# EAGLE design grblduino (EAGLE 5.11)
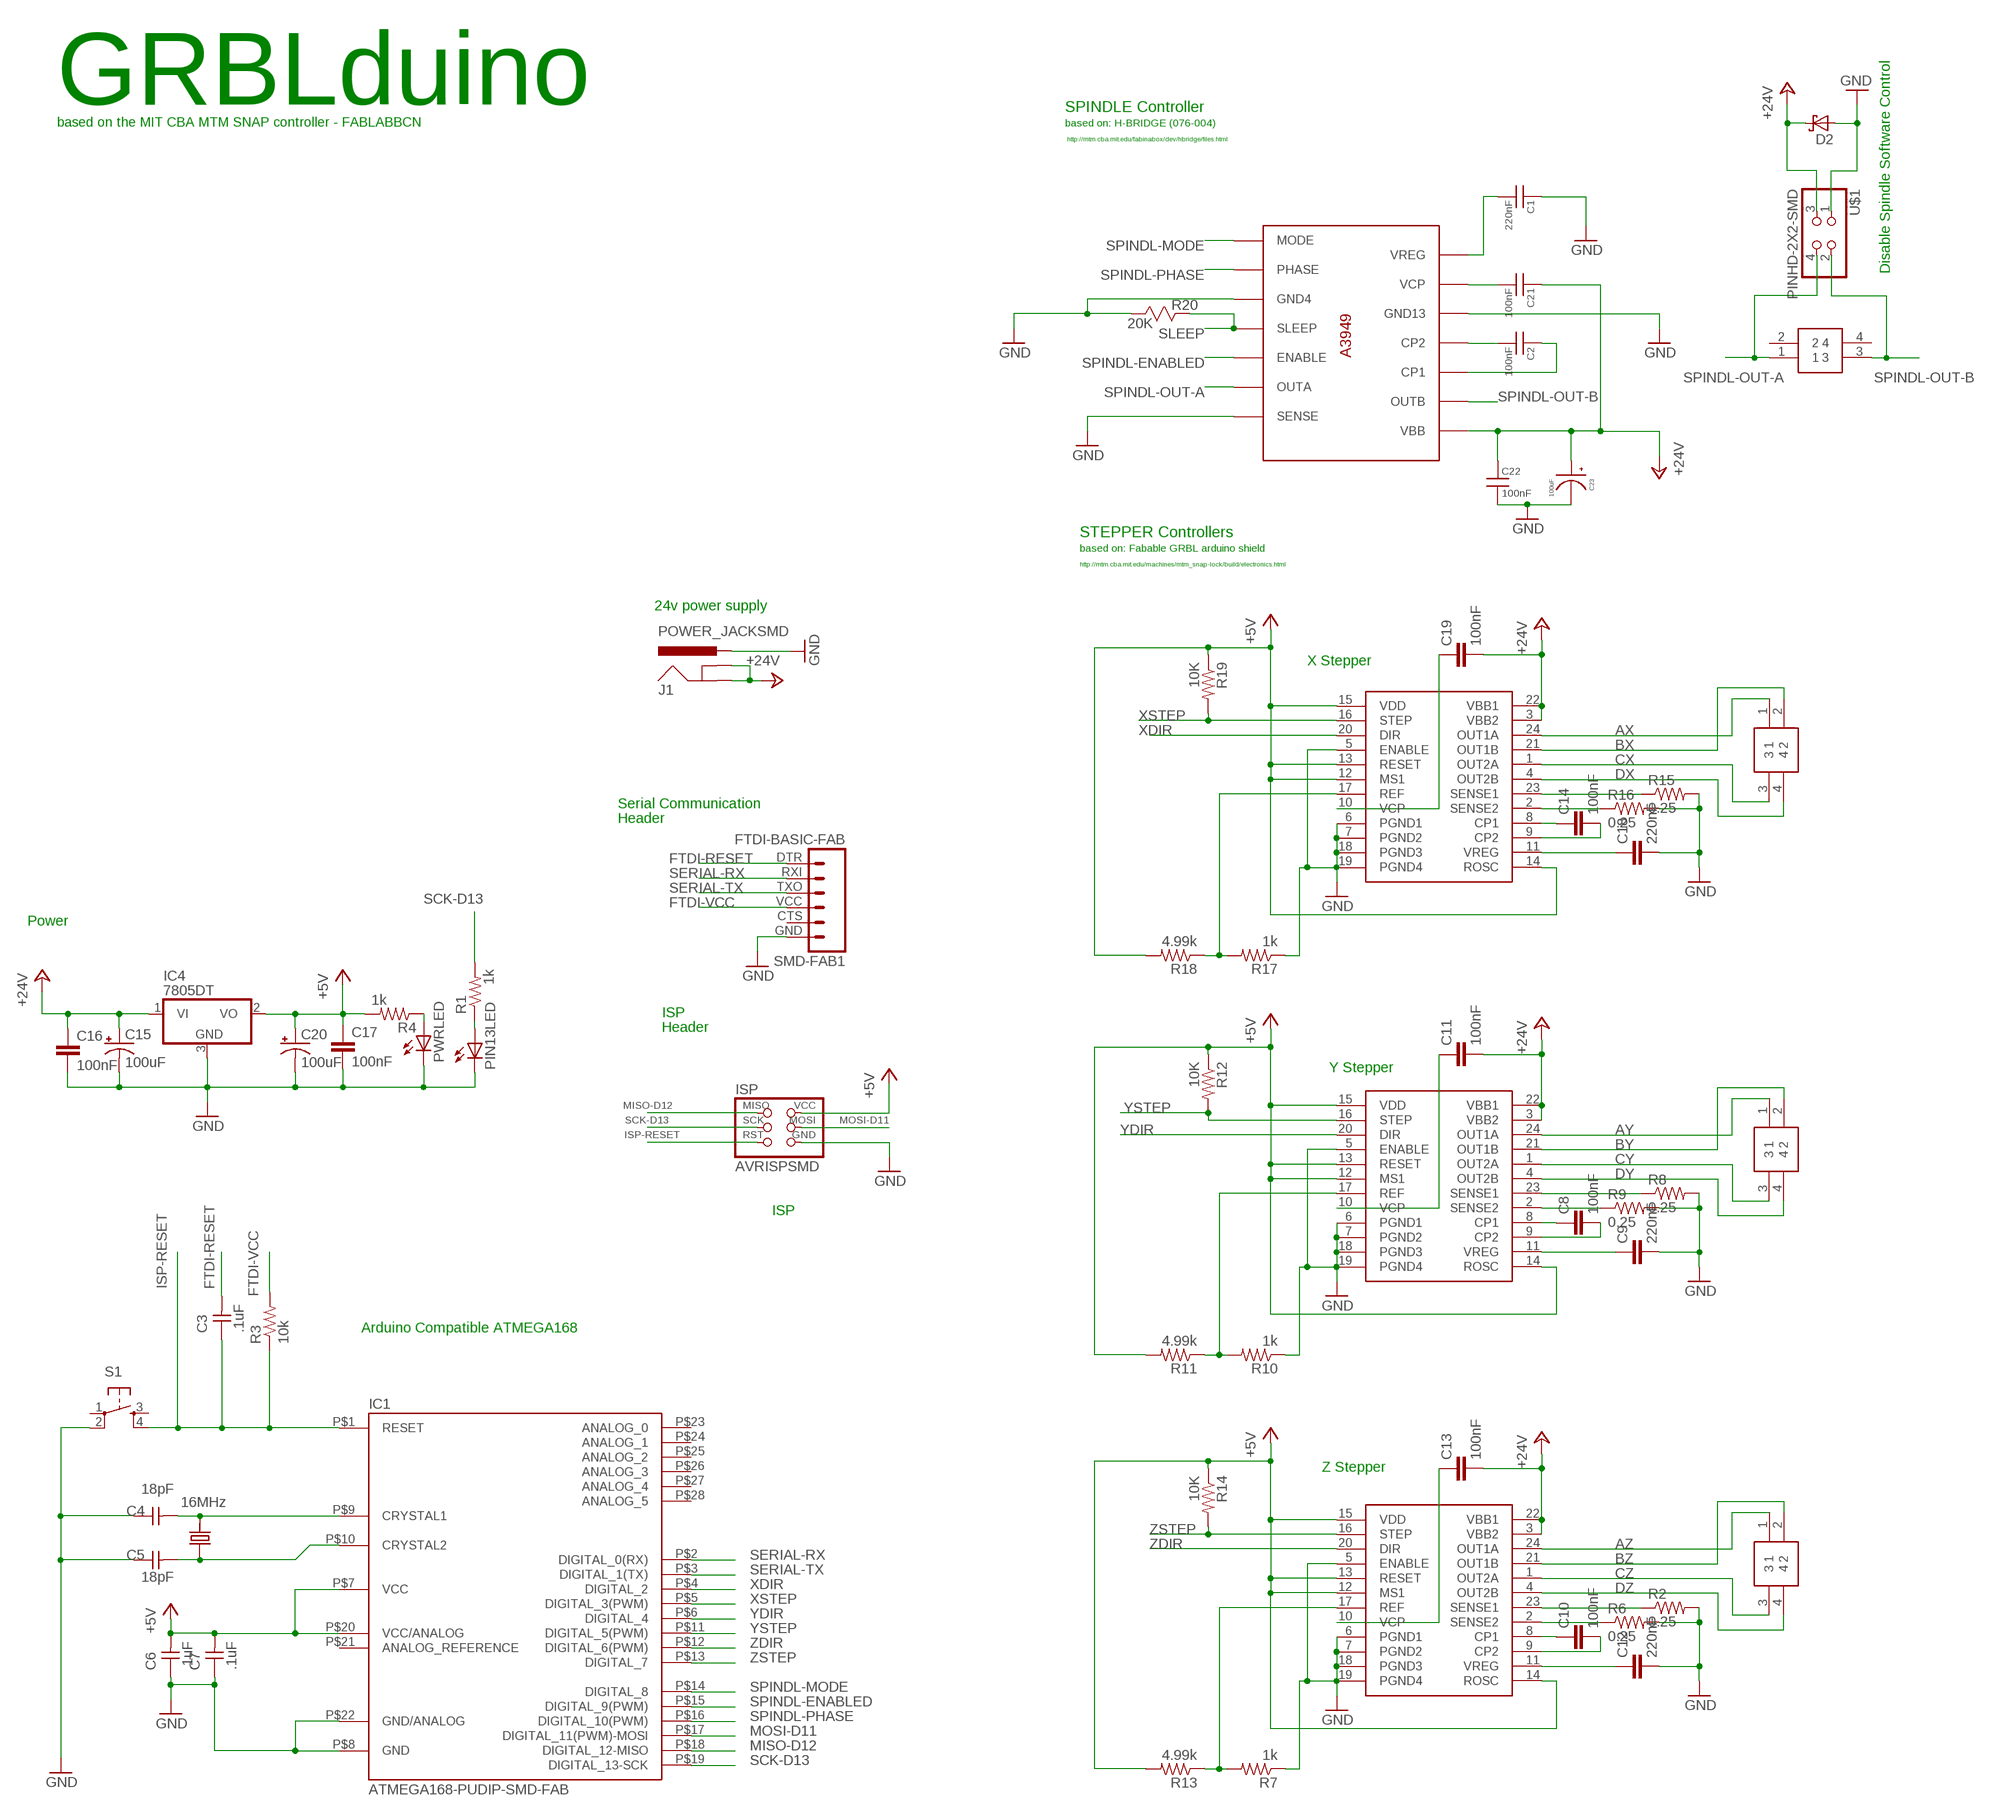
[diagram p0: schematic, sheet 1]

## Parts
C1  220nF  CAP_NONPOLARC1206  [C1206]
C2  100nF  CAP_NONPOLARC1206  [C1206]
C3  .1uF  UNPOLARIZED_CAPACITOR1206  [1206]
C4  18pF  UNPOLARIZED_CAPACITOR1206  [1206]
C5  18pF  UNPOLARIZED_CAPACITOR1206  [1206]
C6  .1uF  UNPOLARIZED_CAPACITOR1206  [1206]
C7  .1uF  UNPOLARIZED_CAPACITOR1206  [1206]
C8  100nF  C-EUC1206  [C1206]
C9  220nF  C-EUC1206  [C1206]
C10  100nF  C-EUC1206  [C1206]
C11  100nF  C-EUC1206  [C1206]
C12  220nF  C-EUC1206  [C1206]
C13  100nF  C-EUC1206  [C1206]
C14  100nF  C-EUC1206  [C1206]
C15  100uF  CPOL-USUD-10X10  [UD-10X10_NICHICON]
C16  100nF  C-EUC1206K  [C1206K]
C17  100nF  C-EUC1206K  [C1206K]
C18  220nF  C-EUC1206  [C1206]
C19  100nF  C-EUC1206  [C1206]
C20  100uF  CPOL-USUD-10X10  [UD-10X10_NICHICON]
C21  100nF  CAP_NONPOLARC1206  [C1206]
C22  100nF  CAP_NONPOLARC1206  [C1206]
C23  100uF  POLAR_CAPACITOR100UF  [ECAP-F]
D2  SCHOTTKY-DIODESMC  [SMC]
DRIVER1  A3982  A3982SOIC24  [SO24W]
DRIVER2  A3982  A3982SOIC24  [SO24W]
DRIVER3  A3982  A3982SOIC24  [SO24W]
IC1  ATMEGA168-PUDIP-SMD-FAB  [DIL28-3-FAB-SMD]
IC4  7805DT  [TO252]
ISP  AVRISPSMD  [2X03SMD]
J1  POWER_JACKSMD  [POWER_JACK_SMD]
PIN13LED  LED1206  [1206]
PWRLED  LED1206  [1206]
Q2  16MHz  CRYSTALCS10  [CS10]
R1  1k  RESISTOR1206  [1206]
R2  0.25  R-US_R2512  [R2512]
R3  10k  RESISTOR1206  [1206]
R4  1k  RESISTOR1206  [1206]
R6  0.25  R-US_R2512  [R2512]
R7  1k  RESISTOR1206  [1206]
R8  0.25  R-US_R2512  [R2512]
R9  0.25  R-US_R2512  [R2512]
R10  1k  RESISTOR1206  [1206]
R11  4.99k  RESISTOR1206  [1206]
R12  10K  R-US_R1206  [R1206]
R13  4.99k  RESISTOR1206  [1206]
R14  10K  R-US_R1206  [R1206]
R15  0.25  R-US_R2512  [R2512]
R16  0.25  R-US_R2512  [R2512]
R17  1k  RESISTOR1206  [1206]
R18  4.99k  RESISTOR1206  [1206]
R19  10K  R-US_R1206  [R1206]
R20  20K  RESISTORR1206  [R1206]
S1  6MM_SWITCH6MM_SWITCH  [6MM_SWITCH]
SMD-FAB1  FTDI-BASIC-FAB  [1X06SMD]
U4  A3949  [SO-16DW]
U$1  PINHD-2X2-SMD  [2X02SMD]
XSTEP  4-HEADER  [4PIN-HEADER]
XSTEP1  4-HEADER  [4PIN-HEADER]
YSTEP  4-HEADER  [4PIN-HEADER]
ZSTEP  4-HEADER  [4PIN-HEADER]

## Nets
+5V [power]: C6.2 C7.2 C17.1 C20.+ DRIVER1.12(MS1) DRIVER1.13(RESET) DRIVER1.14(ROSC) DRIVER1.15(VDD) DRIVER2.12(MS1) DRIVER2.13(RESET) DRIVER2.14(ROSC) DRIVER2.15(VDD) DRIVER3.12(MS1) DRIVER3.13(RESET) DRIVER3.14(ROSC) DRIVER3.15(VDD) IC1.P$7(VCC) IC1.P$20(VCC/ANALOG) IC4.2(VO) ISP.2(VCC) R4.2 R11.2 R12.1 R13.2 R14.1 R18.2 R19.1
+24V: C11.2 C13.2 C15.+ C16.1 C19.2 C21.1(P) C22.1(P) C23.P D2.C DRIVER1.3(VBB2) DRIVER1.22(VBB1) DRIVER2.3(VBB2) DRIVER2.22(VBB1) DRIVER3.3(VBB2) DRIVER3.22(VBB1) IC4.1(VI) J1.GND(GNDBREAK) J1.P$4(GND) U4.9(VBB) U$1.3
AX [power]: DRIVER3.24(OUT1A) XSTEP.1
AY [power]: DRIVER1.24(OUT1A) YSTEP.1
AZ [power]: DRIVER2.24(OUT1A) ZSTEP.1
BX [power]: DRIVER3.21(OUT1B) XSTEP.2
BY [power]: DRIVER1.21(OUT1B) YSTEP.2
BZ [power]: DRIVER2.21(OUT1B) ZSTEP.2
CX [power]: DRIVER3.1(OUT2A) XSTEP.3
CY [power]: DRIVER1.1(OUT2A) YSTEP.3
CZ [power]: DRIVER2.1(OUT2A) ZSTEP.3
DX [power]: DRIVER3.4(OUT2B) XSTEP.4
DY [power]: DRIVER1.4(OUT2B) YSTEP.4
DZ [power]: DRIVER2.4(OUT2B) ZSTEP.4
FTDI-RESET: C3.2 SMD-FAB1.DTR
FTDI-VCC: R3.2 SMD-FAB1.VCC
GND [power]: C1.1(P) C4.1 C5.1 C6.1 C7.1 C9.2 C12.2 C15.- C16.2 C17.2 C18.2 C20.- C22.2(M) C23.N D2.A DRIVER1.5(ENABLE) DRIVER1.6(PGND1) DRIVER1.7(PGND2) DRIVER1.18(PGND3) DRIVER1.19(PGND4) DRIVER2.5(ENABLE) DRIVER2.6(PGND1) DRIVER2.7(PGND2) DRIVER2.18(PGND3) DRIVER2.19(PGND4) DRIVER3.5(ENABLE) DRIVER3.6(PGND1) DRIVER3.7(PGND2) DRIVER3.18(PGND3) DRIVER3.19(PGND4) IC1.P$8(GND) IC1.P$22(GND/ANALOG) IC4.3(GND) ISP.6(GND) J1.VIN0(PWR) PIN13LED.2(C) PWRLED.2(C) R2.2 R6.2 R7.1 R8.2 R9.2 R10.1 R15.2 R16.2 R17.1 R20.1 S1.2(P1) SMD-FAB1.GND U4.4(GND4) U4.8(SENSE) U4.13(GND13) U$1.1
ISP-RESET: C3.1 IC1.P$1(RESET) ISP.5(RST) R3.1 S1.4(S1)
MISO-D12: IC1.P$18(DIGITAL_12-MISO) ISP.1(MISO)
MOSI-D11: IC1.P$17(DIGITAL_11(PWM)-MOSI) ISP.4(MOSI)
N$1: C4.2 IC1.P$9(CRYSTAL1) Q2.P$2
N$2: PWRLED.1(A) R4.1
N$3: C2.1(P) U4.11(CP1)
N$4: PIN13LED.1(A) R1.1
N$5: C5.2 IC1.P$10(CRYSTAL2) Q2.P$1
N$7: C1.2(M) U4.15(VREG)
N$8: C2.2(M) U4.12(CP2)
N$9: C21.2(M) U4.14(VCP)
N$11 [power]: DRIVER2.23(SENSE1) R2.1
N$12 [power]: DRIVER2.2(SENSE2) R6.1
N$13: C10.1 DRIVER2.8(CP1)
N$14: C10.2 DRIVER2.9(CP2)
N$15: C12.1 DRIVER2.11(VREG)
N$16: C13.1 DRIVER2.10(VCP)
N$22: DRIVER2.17(REF) R7.2 R13.1
N$23 [power]: DRIVER3.23(SENSE1) R15.1
N$24 [power]: DRIVER3.2(SENSE2) R16.1
N$25: C14.1 DRIVER3.8(CP1)
N$26: C14.2 DRIVER3.9(CP2)
N$27: C18.1 DRIVER3.11(VREG)
N$28: C19.1 DRIVER3.10(VCP)
N$29: DRIVER3.17(REF) R17.2 R18.1
N$32 [power]: DRIVER1.23(SENSE1) R8.1
N$33 [power]: DRIVER1.2(SENSE2) R9.1
N$34: C8.1 DRIVER1.8(CP1)
N$35: C8.2 DRIVER1.9(CP2)
N$36: C9.1 DRIVER1.11(VREG)
N$37: C11.1 DRIVER1.10(VCP)
N$41: DRIVER1.17(REF) R10.2 R11.1
SCK-D13: IC1.P$19(DIGITAL_13-SCK) ISP.3(SCK) R1.2
SERIAL-RX: IC1.P$2(DIGITAL_0(RX)) SMD-FAB1.RXI
SERIAL-TX: IC1.P$3(DIGITAL_1(TX)) SMD-FAB1.TXO
SLEEP: R20.2 U4.5(SLEEP)
SPINDL-ENABLED: IC1.P$15(DIGITAL_9(PWM)) U4.6(ENABLE)
SPINDL-MODE: IC1.P$14(DIGITAL_8) U4.2(MODE)
SPINDL-OUT-A: U4.7(OUTA) U$1.4 XSTEP1.1
SPINDL-OUT-B: U4.10(OUTB) U$1.2 XSTEP1.3
SPINDL-PHASE: IC1.P$16(DIGITAL_10(PWM)) U4.3(PHASE)
XDIR: DRIVER3.20(DIR) IC1.P$4(DIGITAL_2)
XSTEP: DRIVER3.16(STEP) IC1.P$5(DIGITAL_3(PWM)) R19.2
YDIR: DRIVER1.20(DIR) IC1.P$6(DIGITAL_4)
YSTEP: DRIVER1.16(STEP) IC1.P$11(DIGITAL_5(PWM)) R12.2
ZDIR: DRIVER2.20(DIR) IC1.P$12(DIGITAL_6(PWM))
ZSTEP: DRIVER2.16(STEP) IC1.P$13(DIGITAL_7) R14.2
Unconnected: IC1.P$21(ANALOG_REFERENCE) IC1.P$23(ANALOG_0) IC1.P$24(ANALOG_1) IC1.P$25(ANALOG_2) IC1.P$26(ANALOG_3) IC1.P$27(ANALOG_4) IC1.P$28(ANALOG_5) S1.1(P) S1.3(S) SMD-FAB1.CTS XSTEP1.2 XSTEP1.4

## Notes on the sheet
- GRBLduino
- SPINDLE Controller
- based on the MIT CBA MTM SNAP controller - FABLABBCN | based on: H-BRIDGE (076-004)
- http://mtm.cba.mit.edu/fabinabox/dev/hbridge/files.html
- Disable Spindle Software Control
- STEPPER Controllers
- based on: Fabable GRBL arduino shield
- http://mtm.cba.mit.edu/machines/mtm_snap-lock/build/electronics.html
- 24v power supply
- X Stepper
- Serial Communication
- Header
- Power
- ISP
- Header
- Y Stepper
- ISP
- Arduino Compatible ATMEGA168
- Z Stepper

## Library data of the parts
C1 C2 C21 C22 = Routroller:CAP_NONPOLAR
C3-C7 = ng:UNPOLARIZED_CAPACITOR: unpolarized_capacitor
C8-C14 C16-C19 = rcl:C-EU: CAPACITOR, European symbol
C15 C20 = rcl:CPOL-US: POLARIZED CAPACITOR, American symbol
C23 = MtMM:POLAR_CAPACITOR
D2 = diode:SCHOTTKY-DIODE: Schottky Diode
DRIVER1-DRIVER3 = reprap:A3982
IC1 = Arduino-AVR:ATMEGA168-PU
IC4 = linear:78*: Positive VOLTAGE REGULATOR Source: http://cache.national.com/ds/LM/LM78L05.pdf http://www.fairchildsemi.com/ds/LM/LM7805.pdf
ISP = fab:AVRISP
J1 = SparkFun:POWER_JACK: Power Jack This is the standard 5.5mm barrel jack for power. The PTH is the most common, proven, reliable, footprint. All others are experimental. The Slot footprint only works if the mill layer is transmitted to the PCB fab house so be warned. Spark Fun Electronics SKU : PRT-00119. Mating wall wart : TOL-00298 (and others)
PIN13LED PWRLED = ng:LED
Q2 = ng:CRYSTAL: CRYSTAL
R1 R3 R4 R7 R10 R11 R13 R17 R18 = ng:RESISTOR
R2 R6 R8 R9 R15 R16 = rcl:R-US_: RESISTOR, American symbol
R12 R14 R19 = resistor:R-US_: RESISTOR, American symbol
R20 = Routroller:RESISTOR
S1 = ng:6MM_SWITCH: OMRON SWITCH
SMD-FAB1 = fab:FTDI-BASIC-FAB
U4 = MtMM:A3949
U$1 = fab:PINHD-2X2-SMD
XSTEP XSTEP1 YSTEP ZSTEP = header_new:4-HEADER

## Net classes
0 default: width 0.203 mm, clearance 0.203 mm
1 power: width 0.305 mm, clearance 0.203 mm

## Board
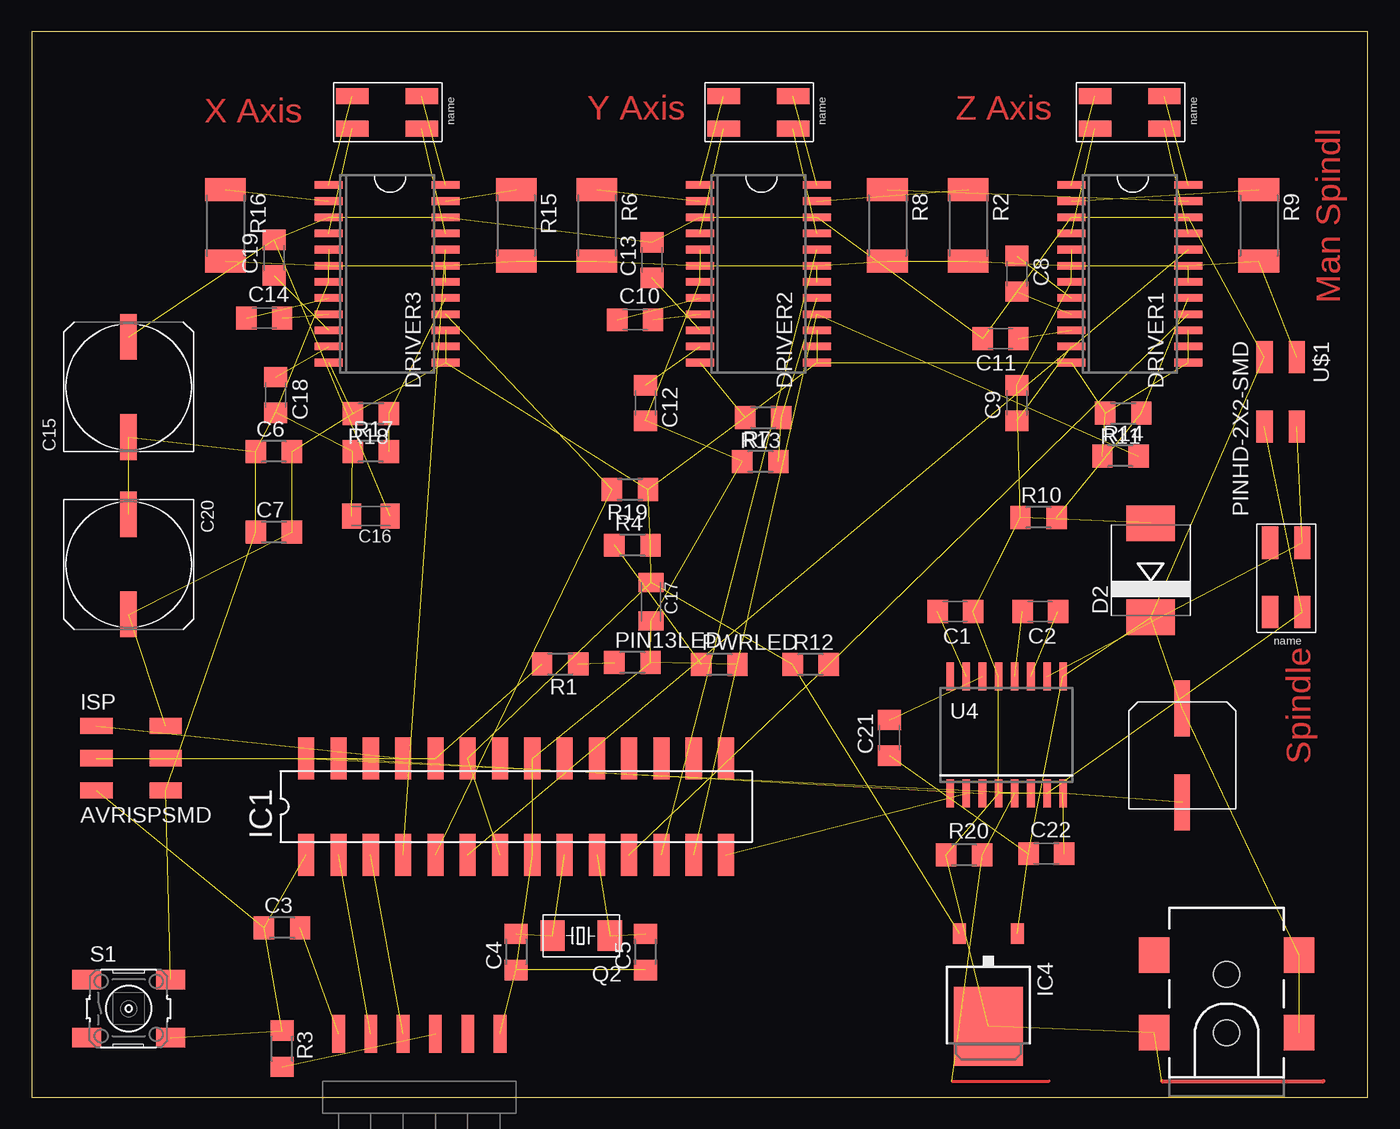
[diagram p1: board, top side]

Size 105.08 x 83.81 mm. Coordinates in mm from the lower left corner, seen from the top.
Outline: 0,0 105.08,0 105.08,83.81 0,83.81 0,0
Copper layers (1*16): Top 0.035mm / dielectric 1.5mm / Bottom 0.035mm
Design rules "default": minimum track width 10mil, minimum drill 24mil, track to track 8mil, track to pad 8mil, pad to pad 8mil, via to via 8mil, smd to smd 8mil, copper to edge 40mil, drill to drill 8mil, minimum pad ring 10mil, minimum via ring 8mil, stop-mask expansion 4mil, vias tented up to drill 0mil, thermal gap 10mil

### Footprints (pad centres in the part's own frame; a part is rotated, then mirrored left to right if it is on the bottom)
C1206 = smd 1.6 x 1.8: 1 -1.4,0; 2 1.4,0
1206 = smd 1.6 x 1.803: 1 -1.422,0; 2 1.422,0
UD-10X10_NICHICON = smd 3.6 x 1.3: + 3.925,0; - -3.95,0
C1206K = smd 1.5 x 2: 1 -1.5,0; 2 1.5,0
ECAP-F = smd 4.4 x 1.2: N -3.7,0; P 3.7,0
SMC = smd 2.8 x 3.8: A 3.7,0; C -3.7,0
SO24W = smd 0.6 x 2.2: 1 -6.985,-4.6; 2 -5.715,-4.6; 3 -4.445,-4.6; 4 -3.175,-4.6; 5 -1.905,-4.6; 6 -0.635,-4.6; 7 0.635,-4.6; 8 1.905,-4.6; 9 3.175,-4.6; 10 4.445,-4.6; 11 5.715,-4.6; 12 6.985,-4.6; 13 6.985,4.6; 14 5.715,4.6; 15 4.445,4.6; 16 3.175,4.6; 17 1.905,4.6; 18 0.635,4.6; 19 -0.635,4.6; 20 -1.905,4.6; 21 -3.175,4.6; 22 -4.445,4.6; 23 -5.715,4.6; 24 -6.985,4.6
DIL28-3-FAB-SMD = smd 1.27 x 3.302: P$1 -16.51,-3.81; P$2 -13.97,-3.81; P$3 -11.43,-3.81; P$4 -8.89,-3.81; P$5 -6.35,-3.81; P$6 -3.81,-3.81; P$7 -1.27,-3.81; P$8 1.27,-3.81; P$9 3.81,-3.81; P$10 6.35,-3.81; P$11 8.89,-3.81; P$12 11.43,-3.81; P$13 13.97,-3.81; P$14 16.51,-3.81; P$15 -16.51,3.81; P$16 -13.97,3.81; P$17 -11.43,3.81; P$18 -8.89,3.81; P$19 -6.35,3.81; P$20 -3.81,3.81; P$21 -1.27,3.81; P$22 1.27,3.81; P$23 3.81,3.81; P$24 6.35,3.81; P$25 8.89,3.81; P$26 11.43,3.81; P$27 13.97,3.81; P$28 16.51,3.81
TO252 = smd 1 x 1.6: 1 -2.28,-4.8; 2 2.28,-4.8 | smd 5.4 x 6.2: 3 0,2.5
2X03SMD = smd 2.54 x 1.27: 1 -2.54,2.54; 2 2.92,2.54; 3 -2.54,0; 4 2.92,0; 5 -2.54,-2.54; 6 2.92,-2.54
POWER_JACK_SMD = smd 2.8 x 2.4: GND 0,-5.7; P$4 6.1,-5.7; VIN0 0,5.7; VIN1 6.1,5.7 | hole 2.032: 0,0; 4.572,0
CS10 = smd 1.905 x 2.388: P$1 -2.286,0; P$2 2.21,0
R2512 = smd 1.8 x 3.2: 1 -2.8,0; 2 2.8,0
R1206 = smd 1.6 x 1.803: 1 -1.422,0; 2 1.422,0
6MM_SWITCH = smd 2.286 x 1.524: 1 -3.302,2.286; 2 3.302,2.286; 3 -3.302,-2.286; 4 3.302,-2.286
1X06SMD = smd 1 x 3: CTS 3.81,5; DTR -6.35,5; GND 6.35,5; RXI -3.81,5; TXO -1.27,5; VCC 1.27,5
SO-16DW = smd 0.6 x 2.2: 1 -4.445,-4.6; 2 -3.175,-4.6; 3 -1.905,-4.6; 4 -0.635,-4.6; 5 0.635,-4.6; 6 1.905,-4.6; 7 3.175,-4.6; 8 4.445,-4.6; 9 4.445,4.6; 10 3.175,4.6; 11 1.905,4.6; 12 0.635,4.6; 13 -0.635,4.6; 14 -1.905,4.6; 15 -3.175,4.6; 16 -4.445,4.6
2X02SMD = smd 2.54 x 1.27: 1 -2.54,1.27; 2 2.92,1.27; 3 -2.54,-1.27; 4 2.92,-1.27
4PIN-HEADER = smd 1.27 x 2.54: 1 -1.27,2.73; 2 1.27,2.73; 3 -1.27,-2.73; 4 1.27,-2.73

### Placement (x,y rotation side)
C1  72.64,38.2 180 top
C2  79.33,38.21 180 top
C3  19.68,13.34 0 top
C4  38.1,11.43 90 top
C5  48.26,11.43 90 top
C6  19.05,50.8 0 top
C7  19.05,44.45 0 top
C8  77.47,64.77 270 top
C9  77.47,54.61 90 top
C10  47.47,61.15 0 top
C11  76.2,59.69 180 top
C12  48.26,54.61 270 top
C13  48.8,65.85 90 top
C14  18.29,61.28 0 top
C15  7.62,55.88 90 top
C16  26.67,45.72 180 top
C17  48.7,38.97 270 top
C18  19.18,55.24 270 top
C19  19.05,66.04 90 top
C20  7.62,41.91 270 top
C21  67.45,28.27 90 top
C22  79.8,19.16 0 top
C23  90.49,26.88 90 top
D2  88.01,41.45 90 top
DRIVER1  86.36,64.77 270 top
DRIVER2  57.15,64.77 270 top
DRIVER3  27.94,64.77 270 top
IC1  38.1,22.86 0 top
IC4  75.25,8.08 180 top
ISP  7.62,26.67 0 top
J1  93.98,5.08 90 top
PIN13LED  47.24,34.19 0 top
PWRLED  54.09,34.04 0 top
Q2  43.18,12.7 180 top
R1  41.56,34.08 180 top
R2  73.66,68.58 270 top
R3  19.68,3.81 270 top
R4  47.24,43.42 0 top
R6  44.45,68.58 270 top
R7  57.31,50.01 0 top
R8  67.31,68.58 270 top
R9  96.52,68.58 270 top
R10  79.18,45.61 0 top
R11  85.85,53.8 180 top
R12  61.26,34.04 0 top
R13  57.53,53.47 180 top
R14  85.63,50.45 0 top
R15  38.1,68.58 270 top
R16  15.24,68.58 270 top
R17  26.67,50.8 0 top
R18  26.67,53.78 180 top
R19  47.05,47.82 180 top
R20  73.34,19.07 0 top
S1  7.62,6.97 0 top
SMD-FAB1  30.48,0 0 top
U4  76.68,28.5 0 top
U$1  98.23,55.67 270 top
XSTEP  27.94,77.47 270 top
XSTEP1  98.66,40.89 180 top
YSTEP  86.36,77.47 270 top
ZSTEP  57.15,77.47 270 top

### Tracks (layer width: path | path; a pad name or v marks a point on that pad's centre or on a via)
+5V  (26 unrouted)
+24V  (19 unrouted)
AX  (1 unrouted)
AY  (1 unrouted)
AZ  (1 unrouted)
BX  (1 unrouted)
BY  (1 unrouted)
BZ  (1 unrouted)
CX  (1 unrouted)
CY  (1 unrouted)
CZ  (1 unrouted)
DX  (1 unrouted)
DY  (1 unrouted)
DZ  (1 unrouted)
FTDI-RESET  (1 unrouted)
FTDI-VCC  (1 unrouted)
GND  (53 unrouted)
  Top 0.305: 88.9,1.27 101.6,1.27
ISP-RESET  (4 unrouted)
MISO-D12  (1 unrouted)
MOSI-D11  (1 unrouted)
N$1  (2 unrouted)
N$2  (1 unrouted)
N$3  (1 unrouted)
N$4  (1 unrouted)
N$5  (2 unrouted)
N$7  (1 unrouted)
N$8  (1 unrouted)
N$9  (1 unrouted)
N$11  (1 unrouted)
N$12  (1 unrouted)
N$13  (1 unrouted)
N$14  (1 unrouted)
N$15  (1 unrouted)
N$16  (1 unrouted)
N$22  (2 unrouted)
N$23  (1 unrouted)
N$24  (1 unrouted)
N$25  (1 unrouted)
N$26  (1 unrouted)
N$27  (1 unrouted)
N$28  (1 unrouted)
N$29  (2 unrouted)
N$32  (1 unrouted)
N$33  (1 unrouted)
N$34  (1 unrouted)
N$35  (1 unrouted)
N$36  (1 unrouted)
N$37  (1 unrouted)
N$41  (2 unrouted)
SCK-D13  (2 unrouted)
SERIAL-RX  (1 unrouted)
SERIAL-TX  (1 unrouted)
SLEEP  (2 unrouted)
  Top 0.254: 72.39,1.27 80.01,1.27
SPINDL-ENABLED  (1 unrouted)
SPINDL-MODE  (1 unrouted)
SPINDL-OUT-A  (2 unrouted)
SPINDL-OUT-B  (2 unrouted)
SPINDL-PHASE  (1 unrouted)
XDIR  (1 unrouted)
XSTEP  (2 unrouted)
YDIR  (1 unrouted)
YSTEP  (2 unrouted)
ZDIR  (1 unrouted)
ZSTEP  (2 unrouted)

### Text on the board
Top: X Axis | Y Axis | Z Axis | Man Spindl | Spindle